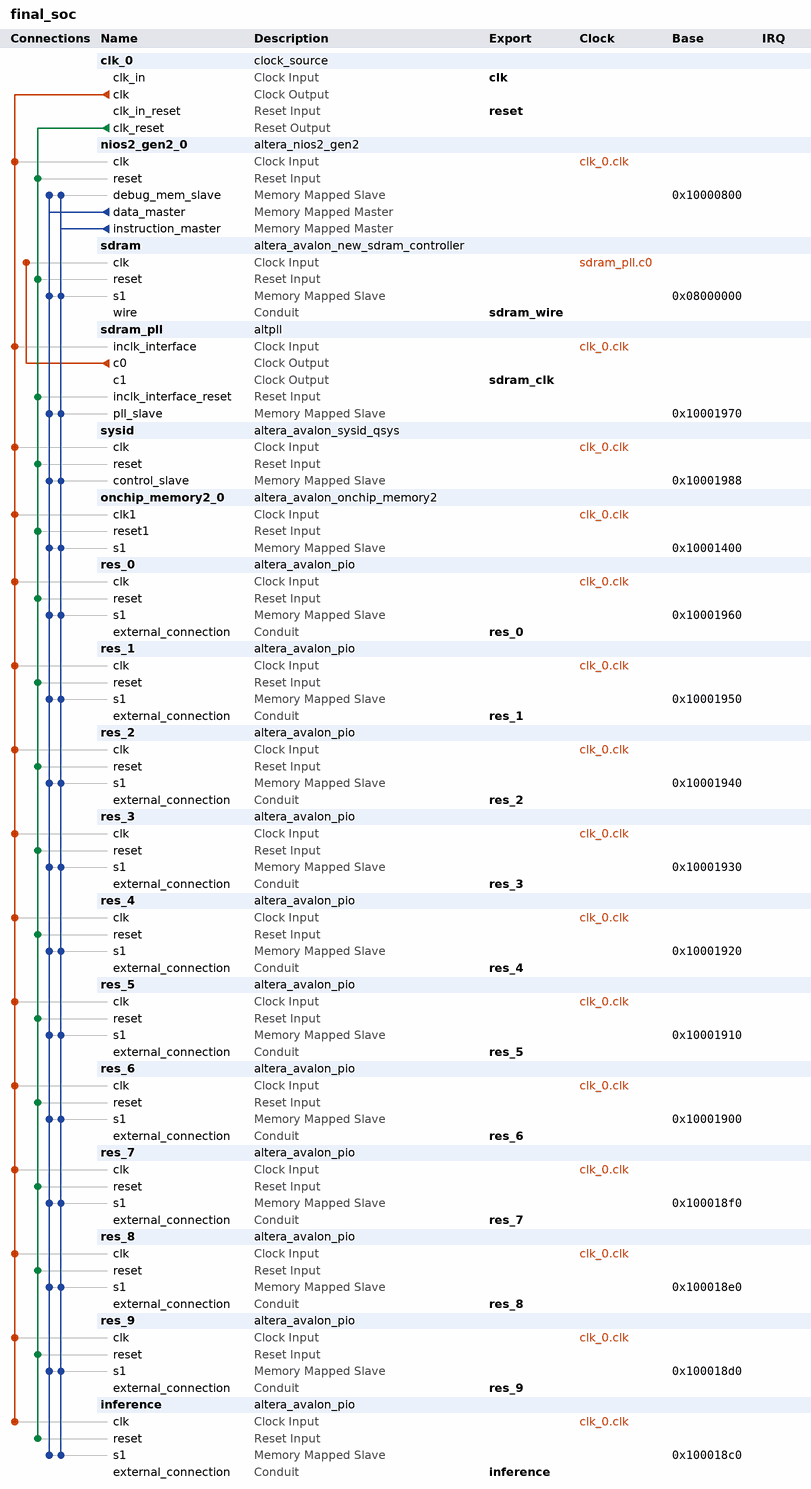
[diagram p0: system contents]
# Platform Designer (Qsys) system final_soc, Cyclone IV E EP4CE115F29C7
# Parameters at their usual value, and those the tool derives, are not listed.
package require -exact qsys 18.0
create_system final_soc
set_project_property DEVICE_FAMILY {Cyclone IV E}
set_project_property DEVICE EP4CE115F29C7

add_instance clk_0 clock_source 18.0
set_instance_parameter_value clk_0 clockFrequency 50000000

add_instance nios2_gen2_0 altera_nios2_gen2 18.0
set_instance_parameter_value nios2_gen2_0 dcache_size 2048
set_instance_parameter_value nios2_gen2_0 exceptionSlave sdram.s1
set_instance_parameter_value nios2_gen2_0 icache_size 4096
set_instance_parameter_value nios2_gen2_0 impl Tiny
set_instance_parameter_value nios2_gen2_0 resetSlave sdram.s1

add_instance sdram altera_avalon_new_sdram_controller 18.0
set_instance_parameter_value sdram TAC 5.5
set_instance_parameter_value sdram TRCD 20.0
set_instance_parameter_value sdram TRP 20.0
set_instance_parameter_value sdram casLatency 3
set_instance_parameter_value sdram columnWidth 10
set_instance_parameter_value sdram dataWidth 32
set_instance_parameter_value sdram generateSimulationModel false
set_instance_parameter_value sdram model single_Micron_MT48LC4M32B2_7_chip
set_instance_parameter_value sdram numberOfBanks 4
set_instance_parameter_value sdram numberOfChipSelects 1
set_instance_parameter_value sdram powerUpDelay 100.0
set_instance_parameter_value sdram refreshPeriod 15.625
set_instance_parameter_value sdram rowWidth 13

add_instance sdram_pll altpll 18.0
set_instance_parameter_value sdram_pll CLK0_DIVIDE_BY 1
set_instance_parameter_value sdram_pll CLK0_MULTIPLY_BY 1
set_instance_parameter_value sdram_pll CLK1_DIVIDE_BY 1
set_instance_parameter_value sdram_pll CLK1_DUTY_CYCLE 50
set_instance_parameter_value sdram_pll CLK1_MULTIPLY_BY 1
set_instance_parameter_value sdram_pll CLK1_PHASE_SHIFT -3000
set_instance_parameter_value sdram_pll INCLK0_INPUT_FREQUENCY 20000
set_instance_parameter_value sdram_pll PORT_ARESET PORT_UNUSED
set_instance_parameter_value sdram_pll PORT_LOCKED PORT_UNUSED
set_instance_parameter_value sdram_pll PORT_clk1 PORT_USED
set_instance_parameter_value sdram_pll PORT_clk2 PORT_UNUSED
set_instance_parameter_value sdram_pll PORT_clk3 PORT_UNUSED

add_instance sysid altera_avalon_sysid_qsys 18.0
set_instance_parameter_value sysid id 0

add_instance onchip_memory2_0 altera_avalon_onchip_memory2 18.0
set_instance_parameter_value onchip_memory2_0 dataWidth 32
set_instance_parameter_value onchip_memory2_0 dualPort false
set_instance_parameter_value onchip_memory2_0 initMemContent true
set_instance_parameter_value onchip_memory2_0 initializationFileName onchip_mem.hex
set_instance_parameter_value onchip_memory2_0 memorySize 1024

add_instance res_0 altera_avalon_pio 18.0
set_instance_parameter_value res_0 direction Input
set_instance_parameter_value res_0 width 32

add_instance res_1 altera_avalon_pio 18.0
set_instance_parameter_value res_1 direction Input
set_instance_parameter_value res_1 width 32

add_instance res_2 altera_avalon_pio 18.0
set_instance_parameter_value res_2 direction Input
set_instance_parameter_value res_2 width 32

add_instance res_3 altera_avalon_pio 18.0
set_instance_parameter_value res_3 direction Input
set_instance_parameter_value res_3 width 32

add_instance res_4 altera_avalon_pio 18.0
set_instance_parameter_value res_4 direction Input
set_instance_parameter_value res_4 width 32

add_instance res_5 altera_avalon_pio 18.0
set_instance_parameter_value res_5 direction Input
set_instance_parameter_value res_5 width 32

add_instance res_6 altera_avalon_pio 18.0
set_instance_parameter_value res_6 direction Input
set_instance_parameter_value res_6 width 32

add_instance res_7 altera_avalon_pio 18.0
set_instance_parameter_value res_7 direction Input
set_instance_parameter_value res_7 width 32

add_instance res_8 altera_avalon_pio 18.0
set_instance_parameter_value res_8 direction Input
set_instance_parameter_value res_8 width 32

add_instance res_9 altera_avalon_pio 18.0
set_instance_parameter_value res_9 direction Input
set_instance_parameter_value res_9 width 32

add_instance inference altera_avalon_pio 18.0
set_instance_parameter_value inference direction Output
set_instance_parameter_value inference width 4

# connections
add_connection clk_0.clk inference.clk clock
add_connection clk_0.clk nios2_gen2_0.clk clock
add_connection clk_0.clk onchip_memory2_0.clk1 clock
add_connection clk_0.clk res_0.clk clock
add_connection clk_0.clk res_1.clk clock
add_connection clk_0.clk res_2.clk clock
add_connection clk_0.clk res_3.clk clock
add_connection clk_0.clk res_4.clk clock
add_connection clk_0.clk res_5.clk clock
add_connection clk_0.clk res_6.clk clock
add_connection clk_0.clk res_7.clk clock
add_connection clk_0.clk res_8.clk clock
add_connection clk_0.clk res_9.clk clock
add_connection clk_0.clk sdram_pll.inclk_interface clock
add_connection clk_0.clk sysid.clk clock
add_connection sdram_pll.c0 sdram.clk clock
add_connection clk_0.clk_reset inference.reset reset
add_connection clk_0.clk_reset nios2_gen2_0.reset reset
add_connection clk_0.clk_reset onchip_memory2_0.reset1 reset
add_connection clk_0.clk_reset res_0.reset reset
add_connection clk_0.clk_reset res_1.reset reset
add_connection clk_0.clk_reset res_2.reset reset
add_connection clk_0.clk_reset res_3.reset reset
add_connection clk_0.clk_reset res_4.reset reset
add_connection clk_0.clk_reset res_5.reset reset
add_connection clk_0.clk_reset res_6.reset reset
add_connection clk_0.clk_reset res_7.reset reset
add_connection clk_0.clk_reset res_8.reset reset
add_connection clk_0.clk_reset res_9.reset reset
add_connection clk_0.clk_reset sdram.reset reset
add_connection clk_0.clk_reset sdram_pll.inclk_interface_reset reset
add_connection clk_0.clk_reset sysid.reset reset
add_connection nios2_gen2_0.data_master inference.s1 avalon
set_connection_parameter_value nios2_gen2_0.data_master/inference.s1 baseAddress 0x100018c0
add_connection nios2_gen2_0.data_master nios2_gen2_0.debug_mem_slave avalon
set_connection_parameter_value nios2_gen2_0.data_master/nios2_gen2_0.debug_mem_slave baseAddress 0x10000800
add_connection nios2_gen2_0.data_master onchip_memory2_0.s1 avalon
set_connection_parameter_value nios2_gen2_0.data_master/onchip_memory2_0.s1 baseAddress 0x10001400
add_connection nios2_gen2_0.data_master res_0.s1 avalon
set_connection_parameter_value nios2_gen2_0.data_master/res_0.s1 baseAddress 0x10001960
add_connection nios2_gen2_0.data_master res_1.s1 avalon
set_connection_parameter_value nios2_gen2_0.data_master/res_1.s1 baseAddress 0x10001950
add_connection nios2_gen2_0.data_master res_2.s1 avalon
set_connection_parameter_value nios2_gen2_0.data_master/res_2.s1 baseAddress 0x10001940
add_connection nios2_gen2_0.data_master res_3.s1 avalon
set_connection_parameter_value nios2_gen2_0.data_master/res_3.s1 baseAddress 0x10001930
add_connection nios2_gen2_0.data_master res_4.s1 avalon
set_connection_parameter_value nios2_gen2_0.data_master/res_4.s1 baseAddress 0x10001920
add_connection nios2_gen2_0.data_master res_5.s1 avalon
set_connection_parameter_value nios2_gen2_0.data_master/res_5.s1 baseAddress 0x10001910
add_connection nios2_gen2_0.data_master res_6.s1 avalon
set_connection_parameter_value nios2_gen2_0.data_master/res_6.s1 baseAddress 0x10001900
add_connection nios2_gen2_0.data_master res_7.s1 avalon
set_connection_parameter_value nios2_gen2_0.data_master/res_7.s1 baseAddress 0x100018f0
add_connection nios2_gen2_0.data_master res_8.s1 avalon
set_connection_parameter_value nios2_gen2_0.data_master/res_8.s1 baseAddress 0x100018e0
add_connection nios2_gen2_0.data_master res_9.s1 avalon
set_connection_parameter_value nios2_gen2_0.data_master/res_9.s1 baseAddress 0x100018d0
add_connection nios2_gen2_0.data_master sdram.s1 avalon
set_connection_parameter_value nios2_gen2_0.data_master/sdram.s1 baseAddress 0x08000000
add_connection nios2_gen2_0.data_master sdram_pll.pll_slave avalon
set_connection_parameter_value nios2_gen2_0.data_master/sdram_pll.pll_slave baseAddress 0x10001970
add_connection nios2_gen2_0.data_master sysid.control_slave avalon
set_connection_parameter_value nios2_gen2_0.data_master/sysid.control_slave baseAddress 0x10001988
add_connection nios2_gen2_0.instruction_master inference.s1 avalon
set_connection_parameter_value nios2_gen2_0.instruction_master/inference.s1 baseAddress 0x100018c0
add_connection nios2_gen2_0.instruction_master nios2_gen2_0.debug_mem_slave avalon
set_connection_parameter_value nios2_gen2_0.instruction_master/nios2_gen2_0.debug_mem_slave baseAddress 0x10000800
add_connection nios2_gen2_0.instruction_master onchip_memory2_0.s1 avalon
set_connection_parameter_value nios2_gen2_0.instruction_master/onchip_memory2_0.s1 baseAddress 0x10001400
add_connection nios2_gen2_0.instruction_master res_0.s1 avalon
set_connection_parameter_value nios2_gen2_0.instruction_master/res_0.s1 baseAddress 0x10001960
add_connection nios2_gen2_0.instruction_master res_1.s1 avalon
set_connection_parameter_value nios2_gen2_0.instruction_master/res_1.s1 baseAddress 0x10001950
add_connection nios2_gen2_0.instruction_master res_2.s1 avalon
set_connection_parameter_value nios2_gen2_0.instruction_master/res_2.s1 baseAddress 0x10001940
add_connection nios2_gen2_0.instruction_master res_3.s1 avalon
set_connection_parameter_value nios2_gen2_0.instruction_master/res_3.s1 baseAddress 0x10001930
add_connection nios2_gen2_0.instruction_master res_4.s1 avalon
set_connection_parameter_value nios2_gen2_0.instruction_master/res_4.s1 baseAddress 0x10001920
add_connection nios2_gen2_0.instruction_master res_5.s1 avalon
set_connection_parameter_value nios2_gen2_0.instruction_master/res_5.s1 baseAddress 0x10001910
add_connection nios2_gen2_0.instruction_master res_6.s1 avalon
set_connection_parameter_value nios2_gen2_0.instruction_master/res_6.s1 baseAddress 0x10001900
add_connection nios2_gen2_0.instruction_master res_7.s1 avalon
set_connection_parameter_value nios2_gen2_0.instruction_master/res_7.s1 baseAddress 0x100018f0
add_connection nios2_gen2_0.instruction_master res_8.s1 avalon
set_connection_parameter_value nios2_gen2_0.instruction_master/res_8.s1 baseAddress 0x100018e0
add_connection nios2_gen2_0.instruction_master res_9.s1 avalon
set_connection_parameter_value nios2_gen2_0.instruction_master/res_9.s1 baseAddress 0x100018d0
add_connection nios2_gen2_0.instruction_master sdram.s1 avalon
set_connection_parameter_value nios2_gen2_0.instruction_master/sdram.s1 baseAddress 0x08000000
add_connection nios2_gen2_0.instruction_master sdram_pll.pll_slave avalon
set_connection_parameter_value nios2_gen2_0.instruction_master/sdram_pll.pll_slave baseAddress 0x10001970
add_connection nios2_gen2_0.instruction_master sysid.control_slave avalon
set_connection_parameter_value nios2_gen2_0.instruction_master/sysid.control_slave baseAddress 0x10001988

# exported interfaces
add_interface clk clock sink
set_interface_property clk EXPORT_OF clk_0.clk_in
add_interface inference conduit end
set_interface_property inference EXPORT_OF inference.external_connection
add_interface res_0 conduit end
set_interface_property res_0 EXPORT_OF res_0.external_connection
add_interface res_1 conduit end
set_interface_property res_1 EXPORT_OF res_1.external_connection
add_interface res_2 conduit end
set_interface_property res_2 EXPORT_OF res_2.external_connection
add_interface res_3 conduit end
set_interface_property res_3 EXPORT_OF res_3.external_connection
add_interface res_4 conduit end
set_interface_property res_4 EXPORT_OF res_4.external_connection
add_interface res_5 conduit end
set_interface_property res_5 EXPORT_OF res_5.external_connection
add_interface res_6 conduit end
set_interface_property res_6 EXPORT_OF res_6.external_connection
add_interface res_7 conduit end
set_interface_property res_7 EXPORT_OF res_7.external_connection
add_interface res_8 conduit end
set_interface_property res_8 EXPORT_OF res_8.external_connection
add_interface res_9 conduit end
set_interface_property res_9 EXPORT_OF res_9.external_connection
add_interface reset reset sink
set_interface_property reset EXPORT_OF clk_0.clk_in_reset
add_interface sdram_clk clock source
set_interface_property sdram_clk EXPORT_OF sdram_pll.c1
add_interface sdram_wire conduit end
set_interface_property sdram_wire EXPORT_OF sdram.wire

set_interconnect_requirement {$system} qsys_mm.clockCrossingAdapter HANDSHAKE
set_interconnect_requirement {$system} qsys_mm.enableEccProtection FALSE
set_interconnect_requirement {$system} qsys_mm.insertDefaultSlave FALSE
set_interconnect_requirement {$system} qsys_mm.maxAdditionalLatency 1

save_system final_soc.qsys
